# EAGLE design TPS630701 - Buck Boost 5V regulator breakout (EAGLE 9.0.0)
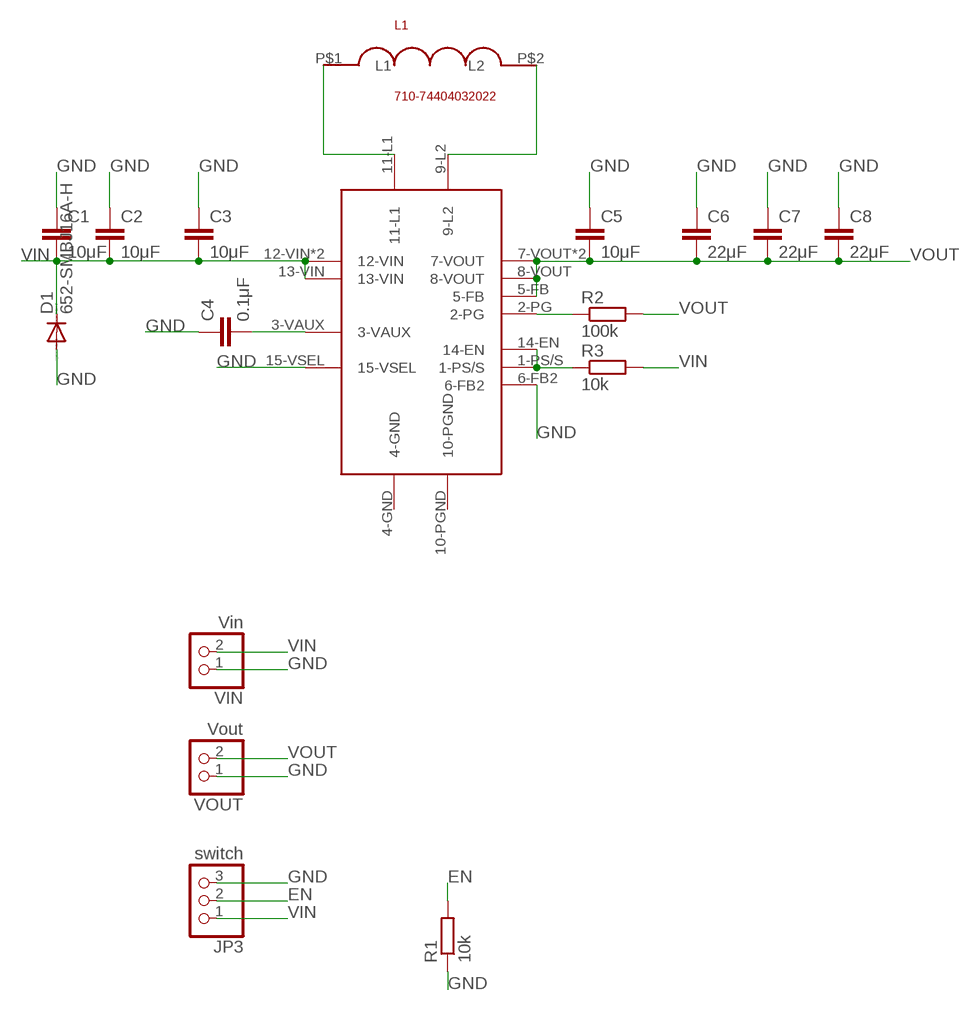
[diagram p0: schematic, sheet 1]

## Parts
C1  10μF  C-EUC0805  [C0805]
C2  10μF  C-EUC0805  [C0805]
C3  10μF  C-EUC0603  [C0603]
C4  0.1μF  C-EUC0805  [C0805]
C5  10μF  C-EUC0603  [C0603]
C6  22μF  C-EUC0805  [C0805]
C7  22μF  C-EUC0805  [C0805]
C8  22μF  C-EUC0805  [C0805]
D1  652-SMBJ16A-H  DIODE-DO214AA  [DO214AA]
IC1  TPS630701RNMT  TPS630701  [VQFN]
JP3  switch  PINHD-1X3  [1X03]
L1  710-74404032022  DJNR3015-1R5  [FFF]
R1  10k  R-EU_R0805  [R0805]
R2  100k  R-EU_R0805  [R0805]
R3  10k  R-EU_R0805  [R0805]
VIN  Vin  PINHD-1X2  [1X02]
VOUT  Vout  PINHD-1X2  [1X02]

## Nets
EN: JP3.2 R1.2
GND: C1.1 C2.1 C3.1 C4.1 C5.1 C6.1 C7.1 C8.1 D1.A IC1.6-FB2 IC1.15-VSEL JP3.3 R1.1 VIN.1 VOUT.1
L1: IC1.11-L1 L1.P$1(L1)
L2: IC1.9-L2 L1.P$2(L2)
N$8: IC1.1-PS/S IC1.14-EN R3.1
PG: IC1.2-PG R2.1
VAUX: C4.2 IC1.3-VAUX
VIN: C1.2 C2.2 C3.2 D1.C IC1.12-VIN IC1.13-VIN IC1.VIN(12-VIN) JP3.1 R3.2 VIN.2
VOUT: C5.2 C6.2 C7.2 C8.2 IC1.5-FB IC1.7-VOUT IC1.8-VOUT IC1.VOUT(7-VOUT) R2.2 VOUT.2
Unconnected: IC1.4-GND IC1.10-PGND

## Library data of the parts
C1-C8 = rcl:C-EU: CAPACITOR, European symbol; SPICEPREFIX: C
D1 = diode:DIODE-: DIODE
IC1 = TPS630701 - Buck Boost 5V regulator:TPS630701
JP3 = pinhead:PINHD-1X3: PIN HEADER
L1 = DJNR3015-1R5 Inductor:DJNR3015-1R5
R1-R3 = rcl:R-EU_: RESISTOR, European symbol; SPICEPREFIX: R
VIN VOUT = pinhead:PINHD-1X2: PIN HEADER

## Board
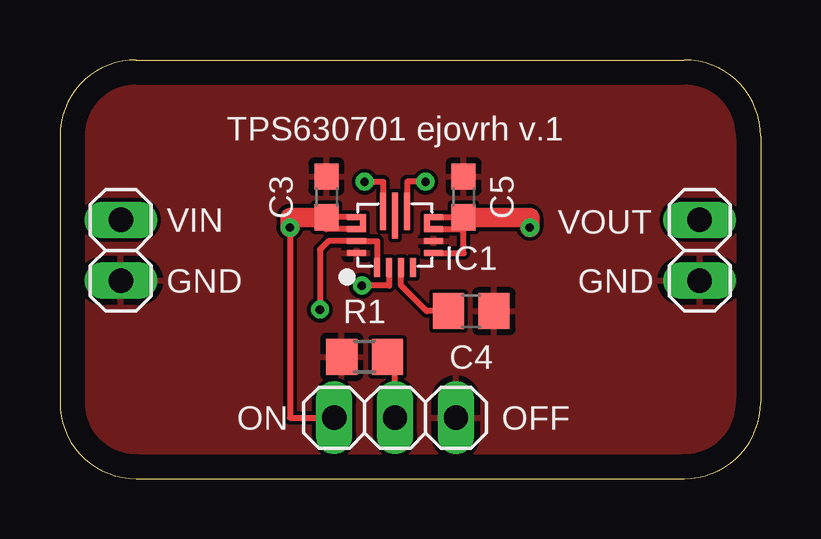
[diagram p1: board, top side]
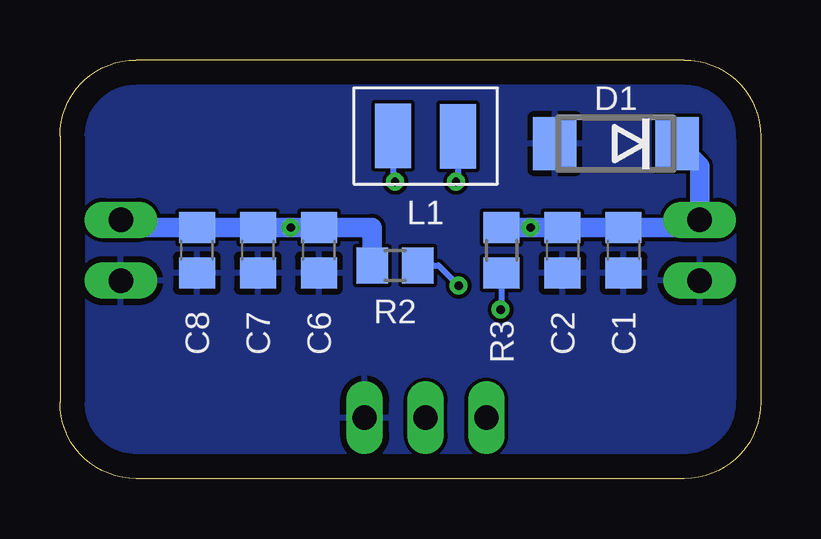
[diagram p2: board, bottom side, seen from below]

Size 29.21 x 17.46 mm. Coordinates in mm from the lower left corner, seen from the top.
Outline: 0,3.18 arc90 3.18,0 26.04,0 arc90 29.21,3.18 29.21,14.29 arc90 26.04,17.46 3.18,17.46 arc90 0,14.29 0,3.18
Copper layers (1*16): Top 0.035mm / dielectric 1.5mm / Bottom 0.035mm
Design rules "default": minimum track width 6mil, minimum drill 0.35mm, track to track 6mil, track to pad 6mil, pad to pad 6mil, via to via 6mil, smd to smd 6mil, copper to edge 40mil, drill to drill 6mil, minimum pad ring 10mil, minimum via ring 8mil, stop-mask expansion 4mil, vias tented up to drill 0mil, thermal gap 10mil

### Footprints (pad centres in the part's own frame; a part is rotated, then mirrored left to right if it is on the bottom)
C0805 = smd 1.3 x 1.5: 1 -0.95,0; 2 0.95,0
C0603 = smd 1.1 x 1: 1 -0.85,0; 2 0.85,0
DO214AA = smd 1.8 x 2.2: A 2.55,0; C -2.55,0
VQFN = smd 0.8 x 0.25: 1-PS/S -1.35,0.75; 2-PG -1.35,0.25; 3-VAUX -1.35,-0.25; 4-GND -1.35,-0.75 | smd 0.25 x 0.8: 5-FB -0.75,-1.6; 6-FB2 -0.25,-1.6; 7-VOUT 0.25,-1.6; 8-VOUT 0.75,-1.6; 12-VIN 0.75,1.6; 13-VIN 0.25,1.6; 14-EN -0.25,1.6; 15-VSEL -0.75,1.6 | smd 1.55 x 0.25: 9-L2 0.99,-0.5; 11-L1 0.99,0.5 | smd 1.9 x 0.25: 10-PGND 0.815,0 | smd 0.6 x 0.25: VIN 0.5,1.325; VOUT 0.505,-1.325
1X03 = drill 1.016 long: 1 -2.54,0; 2 0,0; 3 2.54,0
FFF = smd 1.5 x 2.7: P$1 1.35,-0.01; P$2 -1.35,0.01
R0805 = smd 1.3 x 1.5: 1 -0.95,0; 2 0.95,0
1X02 = drill 1.016 long: 1 -1.27,0; 2 1.27,0

### Placement (x,y rotation side)
C1  5.71,9.53 90 bottom
C2  8.25,9.53 90 bottom
C3  11.11,11.75 270 top
C4  17.14,6.98 180 top
C5  16.83,11.75 270 top
C6  18.41,9.53 90 bottom
C7  20.95,9.53 90 bottom
C8  23.5,9.53 90 bottom
D1  6.03,13.97 180 bottom
IC1  13.97,10.16 90 top
JP3  13.97,2.54 0 top
L1  13.97,14.29 0 bottom
R1  12.7,5.08 0 top
R2  15.24,8.89 180 bottom
R3  10.79,9.53 90 bottom
VIN  2.54,9.53 90 top
VOUT  26.67,9.53 90 top

### Tracks (layer width: path | path; a pad name or v marks a point on that pad's centre or on a via)
EN
  Top 0.254: JP3.2 13.97,4.76 R1.2
GND
  pour Top: -0.16,19.3 29.84,19.3 29.84,-0.7 -0.16,-0.7
  pour Bottom: -0.16,18.35 29.84,18.35 29.84,-0.7 -0.16,-0.7
L1  (via drill 0.35)
  Top 0.254: v12.7,12.38 13.47,12.38 IC1.11-L1
  Bottom 0.254: L1.P$1 12.62,12.46 v12.7,12.38
L2  (via drill 0.35)
  Top 0.254: v15.24,12.38 14.47,12.38 IC1.9-L2
  Bottom 0.254: L1.P$2 15.32,12.46 v15.24,12.38
N$8  (via drill 0.35)
  Top 0.254: IC1.1-PS/S 13.22,9.91 IC1.14-EN 11.2,9.91 10.84,9.55 v10.84,7.05
  Bottom 0.254: R3.1 10.79,7.1 v10.84,7.05
PG  (via drill 0.35)
  Top 0.254: IC1.2-PG 13.72,8.05 v12.59,8.05
  Bottom 0.254: R2.1 13.43,8.89 v12.59,8.05
VAUX
  Top 0.254: IC1.3-VAUX 14.22,8.05 15.29,6.98 C4.2
VIN  (via drill 0.35)
  Top 0.254: IC1.13-VIN 11.11,10.41 C3.2 11.12,10.91 IC1.12-VIN 12.64,10.91 IC1.VIN | v9.59,10.48 9.59,2.54 JP3.1
  Top 0.813: C3.2 9.59,10.9 v9.59,10.48
  Bottom 0.813: R3.2 v9.59,10.48 C2.2 C1.2 2.86,10.48 VIN.2 2.54,13.03 D1.C
VOUT  (via drill 0.35)
  Top 0.254: 16.83,10.41 IC1.7-VOUT 15.29,10.41 IC1.VOUT | IC1.8-VOUT C5.2 16.83,10.41 | IC1.5-FB 16.83,9.41 16.83,10.41
  Top 0.813: C5.2 19.59,10.9 v19.59,10.48
  Bottom 0.813: VOUT.2 26.35,10.48 C8.2 C7.2 v19.59,10.48 C6.2 16.19,10.48 R2.2

### Text on the board
tPlace: TPS630701 ejovrh v.1 | GND | GND | ON | OFF